# EasyEDA Pro project PMactrix.epro

# Schematic Schematic1
Board Name: Board1; Create Date: 2026-05-23; Page Name: P1; Project Name: test; Schematic Name: Schematic1; Update Date: 2026-05-23; Company: EasyEDA.com; Page Size: A4; Version: V1.0
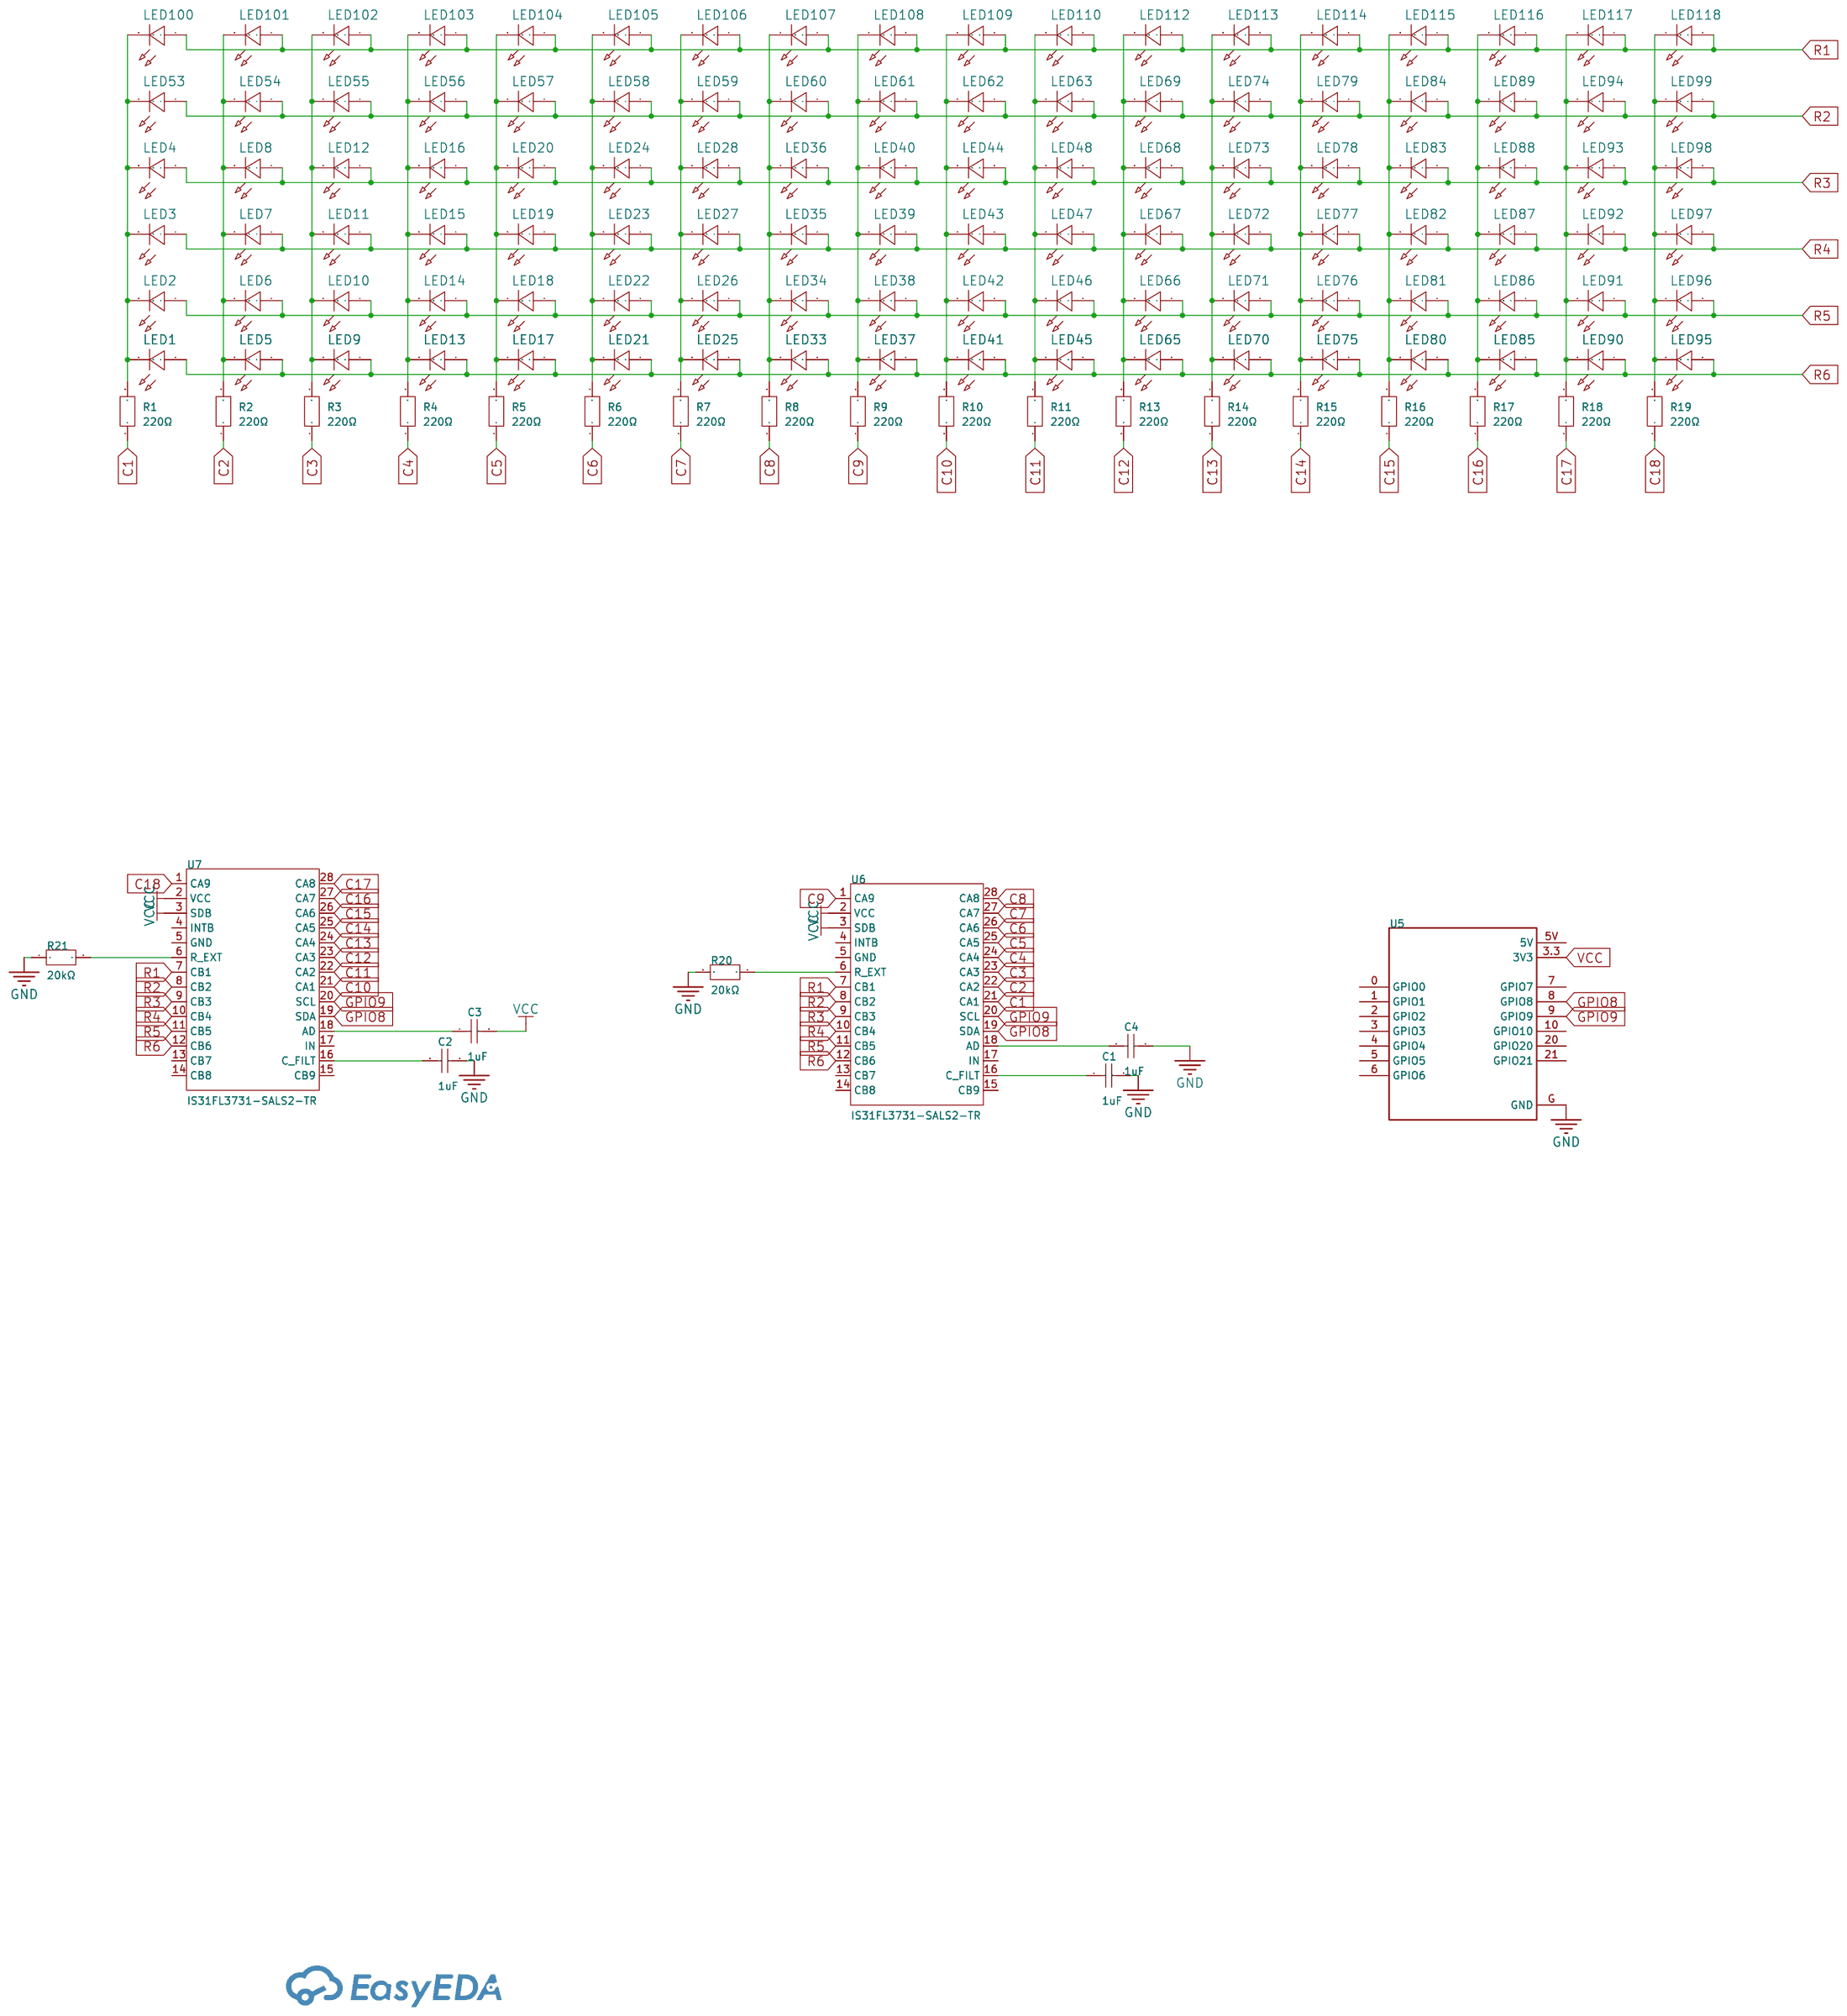
[diagram p0: schematic sheet]

## Parts
C1  1uF  [C0603]
C2  1uF  [C0603]
C3  1uF  [C0603]
C4  1uF  [C0603]
LED1  SZYY0603W  [LED0603-R-RD_WHITE]
LED2  SZYY0603W  [LED0603-R-RD_WHITE]
LED3  SZYY0603W  [LED0603-R-RD_WHITE]
LED4  SZYY0603W  [LED0603-R-RD_WHITE]
LED5  SZYY0603W  [LED0603-R-RD_WHITE]
LED6  SZYY0603W  [LED0603-R-RD_WHITE]
LED7  SZYY0603W  [LED0603-R-RD_WHITE]
LED8  SZYY0603W  [LED0603-R-RD_WHITE]
LED9  SZYY0603W  [LED0603-R-RD_WHITE]
LED10  SZYY0603W  [LED0603-R-RD_WHITE]
LED11  SZYY0603W  [LED0603-R-RD_WHITE]
LED12  SZYY0603W  [LED0603-R-RD_WHITE]
LED13  SZYY0603W  [LED0603-R-RD_WHITE]
LED14  SZYY0603W  [LED0603-R-RD_WHITE]
LED15  SZYY0603W  [LED0603-R-RD_WHITE]
LED16  SZYY0603W  [LED0603-R-RD_WHITE]
LED17  SZYY0603W  [LED0603-R-RD_WHITE]
LED18  SZYY0603W  [LED0603-R-RD_WHITE]
LED19  SZYY0603W  [LED0603-R-RD_WHITE]
LED20  SZYY0603W  [LED0603-R-RD_WHITE]
LED21  SZYY0603W  [LED0603-R-RD_WHITE]
LED22  SZYY0603W  [LED0603-R-RD_WHITE]
LED23  SZYY0603W  [LED0603-R-RD_WHITE]
LED24  SZYY0603W  [LED0603-R-RD_WHITE]
LED25  SZYY0603W  [LED0603-R-RD_WHITE]
LED26  SZYY0603W  [LED0603-R-RD_WHITE]
LED27  SZYY0603W  [LED0603-R-RD_WHITE]
LED28  SZYY0603W  [LED0603-R-RD_WHITE]
LED33  SZYY0603W  [LED0603-R-RD_WHITE]
LED34  SZYY0603W  [LED0603-R-RD_WHITE]
LED35  SZYY0603W  [LED0603-R-RD_WHITE]
LED36  SZYY0603W  [LED0603-R-RD_WHITE]
LED37  SZYY0603W  [LED0603-R-RD_WHITE]
LED38  SZYY0603W  [LED0603-R-RD_WHITE]
LED39  SZYY0603W  [LED0603-R-RD_WHITE]
LED40  SZYY0603W  [LED0603-R-RD_WHITE]
LED41  SZYY0603W  [LED0603-R-RD_WHITE]
LED42  SZYY0603W  [LED0603-R-RD_WHITE]
LED43  SZYY0603W  [LED0603-R-RD_WHITE]
LED44  SZYY0603W  [LED0603-R-RD_WHITE]
LED45  SZYY0603W  [LED0603-R-RD_WHITE]
LED46  SZYY0603W  [LED0603-R-RD_WHITE]
LED47  SZYY0603W  [LED0603-R-RD_WHITE]
LED48  SZYY0603W  [LED0603-R-RD_WHITE]
LED53  SZYY0603W  [LED0603-R-RD_WHITE]
LED54  SZYY0603W  [LED0603-R-RD_WHITE]
LED55  SZYY0603W  [LED0603-R-RD_WHITE]
LED56  SZYY0603W  [LED0603-R-RD_WHITE]
LED57  SZYY0603W  [LED0603-R-RD_WHITE]
LED58  SZYY0603W  [LED0603-R-RD_WHITE]
LED59  SZYY0603W  [LED0603-R-RD_WHITE]
LED60  SZYY0603W  [LED0603-R-RD_WHITE]
LED61  SZYY0603W  [LED0603-R-RD_WHITE]
LED62  SZYY0603W  [LED0603-R-RD_WHITE]
LED63  SZYY0603W  [LED0603-R-RD_WHITE]
LED65  SZYY0603W  [LED0603-R-RD_WHITE]
LED66  SZYY0603W  [LED0603-R-RD_WHITE]
LED67  SZYY0603W  [LED0603-R-RD_WHITE]
LED68  SZYY0603W  [LED0603-R-RD_WHITE]
LED69  SZYY0603W  [LED0603-R-RD_WHITE]
LED70  SZYY0603W  [LED0603-R-RD_WHITE]
LED71  SZYY0603W  [LED0603-R-RD_WHITE]
LED72  SZYY0603W  [LED0603-R-RD_WHITE]
LED73  SZYY0603W  [LED0603-R-RD_WHITE]
LED74  SZYY0603W  [LED0603-R-RD_WHITE]
LED75  SZYY0603W  [LED0603-R-RD_WHITE]
LED76  SZYY0603W  [LED0603-R-RD_WHITE]
LED77  SZYY0603W  [LED0603-R-RD_WHITE]
LED78  SZYY0603W  [LED0603-R-RD_WHITE]
LED79  SZYY0603W  [LED0603-R-RD_WHITE]
LED80  SZYY0603W  [LED0603-R-RD_WHITE]
LED81  SZYY0603W  [LED0603-R-RD_WHITE]
LED82  SZYY0603W  [LED0603-R-RD_WHITE]
LED83  SZYY0603W  [LED0603-R-RD_WHITE]
LED84  SZYY0603W  [LED0603-R-RD_WHITE]
LED85  SZYY0603W  [LED0603-R-RD_WHITE]
LED86  SZYY0603W  [LED0603-R-RD_WHITE]
LED87  SZYY0603W  [LED0603-R-RD_WHITE]
LED88  SZYY0603W  [LED0603-R-RD_WHITE]
LED89  SZYY0603W  [LED0603-R-RD_WHITE]
LED90  SZYY0603W  [LED0603-R-RD_WHITE]
LED91  SZYY0603W  [LED0603-R-RD_WHITE]
LED92  SZYY0603W  [LED0603-R-RD_WHITE]
LED93  SZYY0603W  [LED0603-R-RD_WHITE]
LED94  SZYY0603W  [LED0603-R-RD_WHITE]
LED95  SZYY0603W  [LED0603-R-RD_WHITE]
LED96  SZYY0603W  [LED0603-R-RD_WHITE]
LED97  SZYY0603W  [LED0603-R-RD_WHITE]
LED98  SZYY0603W  [LED0603-R-RD_WHITE]
LED99  SZYY0603W  [LED0603-R-RD_WHITE]
LED100  SZYY0603W  [LED0603-R-RD_WHITE]
LED101  SZYY0603W  [LED0603-R-RD_WHITE]
LED102  SZYY0603W  [LED0603-R-RD_WHITE]
LED103  SZYY0603W  [LED0603-R-RD_WHITE]
LED104  SZYY0603W  [LED0603-R-RD_WHITE]
LED105  SZYY0603W  [LED0603-R-RD_WHITE]
LED106  SZYY0603W  [LED0603-R-RD_WHITE]
LED107  SZYY0603W  [LED0603-R-RD_WHITE]
LED108  SZYY0603W  [LED0603-R-RD_WHITE]
LED109  SZYY0603W  [LED0603-R-RD_WHITE]
LED110  SZYY0603W  [LED0603-R-RD_WHITE]
LED112  SZYY0603W  [LED0603-R-RD_WHITE]
LED113  SZYY0603W  [LED0603-R-RD_WHITE]
LED114  SZYY0603W  [LED0603-R-RD_WHITE]
LED115  SZYY0603W  [LED0603-R-RD_WHITE]
LED116  SZYY0603W  [LED0603-R-RD_WHITE]
LED117  SZYY0603W  [LED0603-R-RD_WHITE]
LED118  SZYY0603W  [LED0603-R-RD_WHITE]
R1  220Ω  [R0603]
R2  220Ω  [R0603]
R3  220Ω  [R0603]
R4  220Ω  [R0603]
R5  220Ω  [R0603]
R6  220Ω  [R0603]
R7  220Ω  [R0603]
R8  220Ω  [R0603]
R9  220Ω  [R0603]
R10  220Ω  [R0603]
R11  220Ω  [R0603]
R13  220Ω  [R0603]
R14  220Ω  [R0603]
R15  220Ω  [R0603]
R16  220Ω  [R0603]
R17  220Ω  [R0603]
R18  220Ω  [R0603]
R19  220Ω  [R0603]
R20  20kΩ  [R0603]
R21  20kΩ  [R0603]
U5  -  [MODULE_ESP32-C3_SUPERMINI_TH]
U6  IS31FL3731-SALS2-TR  [SSOP-28_L10.2-W5.3-P0.65-LS7.8-BL]
U7  IS31FL3731-SALS2-TR  [SSOP-28_L10.2-W5.3-P0.65-LS7.8-BL]

## Library data of the parts
C1-C4 = CL10B105KA8NNNC: Capacitance:1uF Tolerance:±10% Tolerance:±10% Voltage Rating:25V Temperature Coefficient:X7R; LCSC Part Name: 1uF ±10% 25V; Supplier Part: C29936; Manufacturer: SAMSUNG(三星); Supplier Footprint: 0603; JLCPCB Part Class: Extended Part; Datasheet: https://item.szlcsc.com/datasheet/CL10B105KA8NNNC/30690.html; Supplier: LCSC; Tolerance: ±10%; Voltage Rating: 25V; Temperature Coefficient: X7R
LED1-LED28 LED33-LED48 LED53-LED63 LED65-LED110 LED112-LED118 = SZYY0603W: Lamp Holder Type:- Illumination Color:White Voltage - Forward(Vf):3.1V Voltage - Forward(Vf):3.1V Power(Watts):100mW Forward Current:30mA Wavelength - Dominant:- Wavelength - Dominant:- Peak Wavelength:- Diode Configuration:Discrete Diode Lens Color:Yello; LCSC Part Name: 白灯; Supplier Part: C434422; Manufacturer: yongyu(永裕光电); Supplier Footprint: 0603; JLCPCB Part Class: Extended Part; Datasheet: https://item.szlcsc.com/datasheet/SZYY0603W/431704.html; Supplier: LCSC; Illumination Color: White; Voltage - Forward(Vf): 3.1V; Power(Watts): 100mW; Forward Current: 30mA; Diode Configuration: Discrete Diode; Lens Color: Yellow Lens; Luminous Intensity: 359mcd; Viewing Angle: 120°; Operating Temperature: -40℃~+85℃
R1-R11 R13-R19 = CR0603F220RP05Z: Type:Thick Film Resistors Resistance: Tolerance:±1% Tolerance:±1% Power(Watts): Temperature Coefficient:±100ppm/℃ Temperature Coefficient:±100ppm/℃ Operating Temperature Range:-55℃~+155℃ Operating Temperature Range:-55℃~+155℃; LCSC Part Name: 厚膜电阻 220Ω ±1% 100mW; Supplier Part: C881327; Manufacturer: EVER OHMS(天二科技); Supplier Footprint: 0603; JLCPCB Part Class: Extended Part; Datasheet: https://atta.szlcsc.com/upload/public/pdf/source/20201014/C881429_ABC29D63C8D6A11EB63D87348B25AA7B.pdf; Supplier: LCSC; Type: Thick Film Resistors; Tolerance: ±1%; Temperature Coefficient: ±100ppm/℃; Operating Temperature Range: -55℃~+155℃
R20 R21 = FRC0603F2002TS: Type:Thick Film Resistor Resistance:20kΩ Tolerance:±1% Tolerance:±1% Power(Watts):100mW Voltage-Supply(Max):75V Temperature Coefficient:±100ppm/℃ Temperature Coefficient:±100ppm/℃ Operating Temperature:-55℃~+155℃ Operating Temperature:-55℃~+155℃; LCSC Part Name: 20kΩ ±1% 100mW 厚膜电阻; Supplier Part: C2907011; Manufacturer: FOJAN(富捷); Supplier Footprint: 0603; JLCPCB Part Class: Extended Part; Supplier: LCSC; Type: Thick Film Resistor; Tolerance: ±1%; Power(Watts): 100mW; Voltage-Supply(Max): 75V; Temperature Coefficient: ±100ppm/℃; Operating Temperature: -55℃~+155℃
U5 = ESP32-C3_SUPERMINI 1
U6 U7 = IS31FL3731-SALS2-TR: Type:- Voltage - Input(DC):2.7V~5.5V Voltage - Input(DC):2.7V~5.5V Frequency - Switching:400kHz Frequency - Switching:400kHz Number of Channels:18 Output Voltage:- Output Voltage:- Output Current:34mA Dimming:PWM Features:- Voltage - Input(AC):- Voltage -; Supplier Part: C2940545; Manufacturer: ISSI(美国芯成); Supplier Footprint: SSOP-28-208mil; JLCPCB Part Class: Extended Part; Datasheet: https://item.szlcsc.com/datasheet/IS31FL3731-SALS2-TR/3305928.html; Supplier: LCSC; Voltage - Input(DC): 2.7V~5.5V; Frequency - Switching: 400kHz; Number of Channels: 18; Output Current: 34mA; Dimming: PWM; Operating temperature: -40℃~+85℃; Switch Tube (Built-In/External): External

## Nets
GND: C1.2 C2.2 C4.2 R20.1 R21.1 U5.G(GND)
VCC: C3.2 U5.3.3(3V3) U6.2(VCC) U6.3(SDB) U7.2(VCC) U7.3(SDB)
C1: R1.1 U6.21(CA1)
C2: R2.1 U6.22(CA2)
C3: R3.1 U6.23(CA3)
C4: R4.1 U6.24(CA4)
C5: R5.1 U6.25(CA5)
C6: R6.1 U6.26(CA6)
C7: R7.1 U6.27(CA7)
C8: R8.1 U6.28(CA8)
C9: R9.1 U6.1(CA9)
C10: R10.1 U7.21(CA1)
C11: R11.1 U7.22(CA2)
C12: R13.1 U7.23(CA3)
C13: R14.1 U7.24(CA4)
C14: R15.1 U7.25(CA5)
C15: R16.1 U7.26(CA6)
C16: R17.1 U7.27(CA7)
C17: R18.1 U7.28(CA8)
C18: R19.1 U7.1(CA9)
GPIO8: U5.8(GPIO8) U6.19(SDA) U7.19(SDA)
GPIO9: U5.9(GPIO9) U6.20(SCL) U7.20(SCL)
R1: LED100.1(A) LED101.1(A) LED102.1(A) LED103.1(A) LED104.1(A) LED105.1(A) LED106.1(A) LED107.1(A) LED108.1(A) LED109.1(A) LED110.1(A) LED112.1(A) LED113.1(A) LED114.1(A) LED115.1(A) LED116.1(A) LED117.1(A) LED118.1(A) U6.7(CB1) U7.7(CB1)
R2: LED53.1(A) LED54.1(A) LED55.1(A) LED56.1(A) LED57.1(A) LED58.1(A) LED59.1(A) LED60.1(A) LED61.1(A) LED62.1(A) LED63.1(A) LED69.1(A) LED74.1(A) LED79.1(A) LED84.1(A) LED89.1(A) LED94.1(A) LED99.1(A) U6.8(CB2) U7.8(CB2)
R3: LED4.1(A) LED8.1(A) LED12.1(A) LED16.1(A) LED20.1(A) LED24.1(A) LED28.1(A) LED36.1(A) LED40.1(A) LED44.1(A) LED48.1(A) LED68.1(A) LED73.1(A) LED78.1(A) LED83.1(A) LED88.1(A) LED93.1(A) LED98.1(A) U6.9(CB3) U7.9(CB3)
R4: LED3.1(A) LED7.1(A) LED11.1(A) LED15.1(A) LED19.1(A) LED23.1(A) LED27.1(A) LED35.1(A) LED39.1(A) LED43.1(A) LED47.1(A) LED67.1(A) LED72.1(A) LED77.1(A) LED82.1(A) LED87.1(A) LED92.1(A) LED97.1(A) U6.10(CB4) U7.10(CB4)
R5: LED2.1(A) LED6.1(A) LED10.1(A) LED14.1(A) LED18.1(A) LED22.1(A) LED26.1(A) LED34.1(A) LED38.1(A) LED42.1(A) LED46.1(A) LED66.1(A) LED71.1(A) LED76.1(A) LED81.1(A) LED86.1(A) LED91.1(A) LED96.1(A) U6.11(CB5) U7.11(CB5)
R6: LED1.1(A) LED5.1(A) LED9.1(A) LED13.1(A) LED17.1(A) LED21.1(A) LED25.1(A) LED33.1(A) LED37.1(A) LED41.1(A) LED45.1(A) LED65.1(A) LED70.1(A) LED75.1(A) LED80.1(A) LED85.1(A) LED90.1(A) LED95.1(A) U6.12(CB6) U7.12(CB6)
$1N8371: LED1.2(C) LED2.2(C) LED3.2(C) LED4.2(C) LED53.2(C) LED100.2(C) R1.2
$1N8417: LED5.2(C) LED6.2(C) LED7.2(C) LED8.2(C) LED54.2(C) LED101.2(C) R2.2
$1N8463: LED9.2(C) LED10.2(C) LED11.2(C) LED12.2(C) LED55.2(C) LED102.2(C) R3.2
$1N8509: LED13.2(C) LED14.2(C) LED15.2(C) LED16.2(C) LED56.2(C) LED103.2(C) R4.2
$1N8555: LED17.2(C) LED18.2(C) LED19.2(C) LED20.2(C) LED57.2(C) LED104.2(C) R5.2
$1N8601: LED21.2(C) LED22.2(C) LED23.2(C) LED24.2(C) LED58.2(C) LED105.2(C) R6.2
$1N8647: LED25.2(C) LED26.2(C) LED27.2(C) LED28.2(C) LED59.2(C) LED106.2(C) R7.2
$1N8693: LED33.2(C) LED34.2(C) LED35.2(C) LED36.2(C) LED60.2(C) LED107.2(C) R8.2
$1N8739: LED37.2(C) LED38.2(C) LED39.2(C) LED40.2(C) LED61.2(C) LED108.2(C) R9.2
$1N8785: LED41.2(C) LED42.2(C) LED43.2(C) LED44.2(C) LED62.2(C) LED109.2(C) R10.2
$1N8831: LED45.2(C) LED46.2(C) LED47.2(C) LED48.2(C) LED63.2(C) LED110.2(C) R11.2
$1N31146: LED65.2(C) LED66.2(C) LED67.2(C) LED68.2(C) LED69.2(C) LED112.2(C) R13.2
$1N31526: LED70.2(C) LED71.2(C) LED72.2(C) LED73.2(C) LED74.2(C) LED113.2(C) R14.2
$1N31916: LED75.2(C) LED76.2(C) LED77.2(C) LED78.2(C) LED79.2(C) LED114.2(C) R15.2
$1N32316: LED80.2(C) LED81.2(C) LED82.2(C) LED83.2(C) LED84.2(C) LED115.2(C) R16.2
$1N32726: LED85.2(C) LED86.2(C) LED87.2(C) LED88.2(C) LED89.2(C) LED116.2(C) R17.2
$1N33146: LED90.2(C) LED91.2(C) LED92.2(C) LED93.2(C) LED94.2(C) LED117.2(C) R18.2
$1N33576: LED95.2(C) LED96.2(C) LED97.2(C) LED98.2(C) LED99.2(C) LED118.2(C) R19.2
$1N35107: R20.2 U6.6(R_EXT)
$1N35273: C1.1 U6.16(C_FILT)
$1N35811: C2.1 U7.16(C_FILT)
$1N35823: R21.2 U7.6(R_EXT)
$1N36756: C3.1 U7.18(AD)
$1N36796: C4.1 U6.18(AD)

Not connected (* = marked no-connect by the designer): U5 0(GPIO0) 1(GPIO1) 2(GPIO2) 3(GPIO3) 4(GPIO4) 5(GPIO5) 5V 6(GPIO6) 7(GPIO7) 10(GPIO10) 20(GPIO20) 21(GPIO21); U6 4(INTB) 5(GND) 13(CB7) 14(CB8) 15(CB9) 17(IN); U7 4(INTB) 5(GND) 13(CB7) 14(CB8) 15(CB9) 17(IN)

# Board PCB1
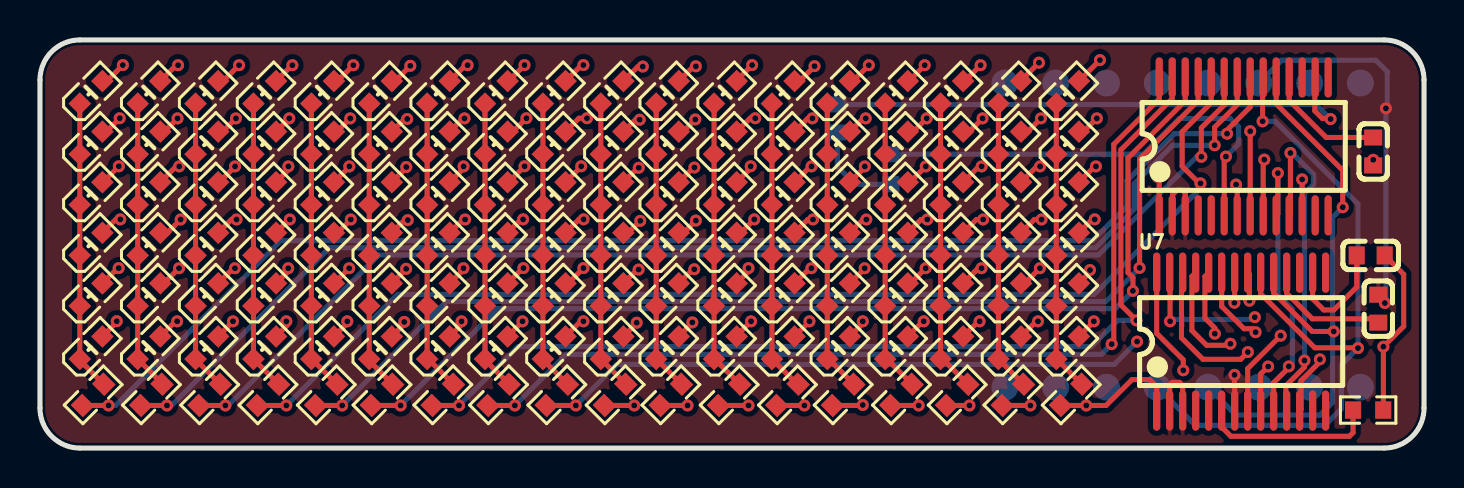
[diagram p1: board, top side]
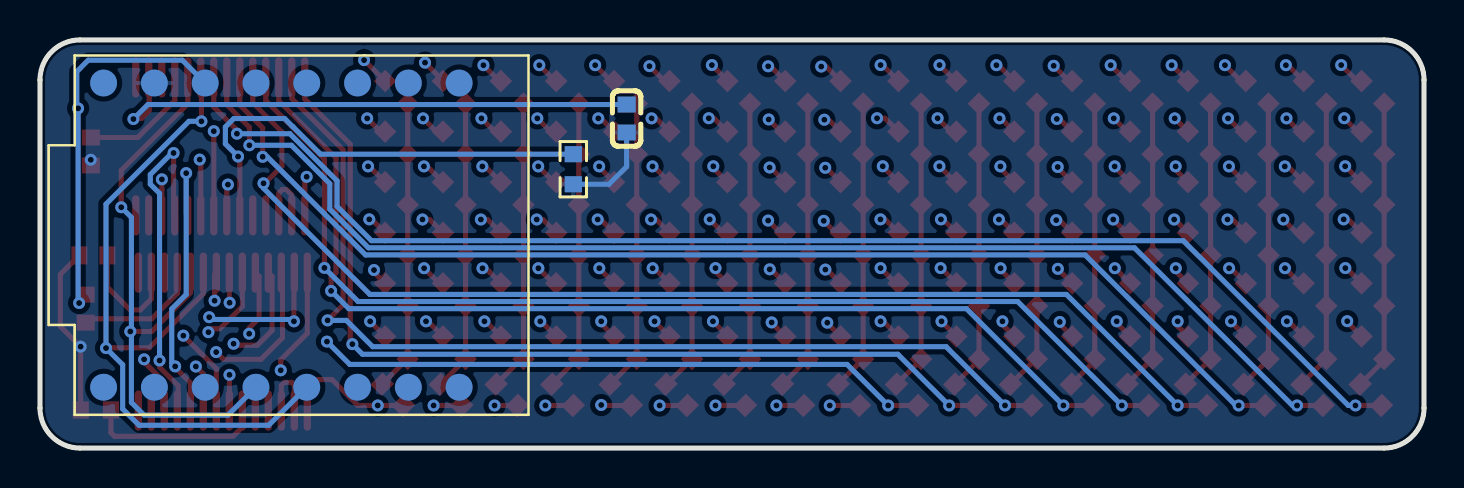
[diagram p2: board, bottom side, seen from below]

Outline 69.22 x 20.45 mm; copper layers: Top Layer, Inner1, Inner2, Bottom Layer. Coordinates in mm from the lower left corner of the outline.
Outline path: 0,18.45 0,2 arc(0.59,0.59) 2,0 67.22,0 arc(68.63,0.59) 69.22,2 69.22,18.45 arc(68.63,19.86) 67.22,20.45 2,20.45 arc(0.59,19.86) 0,18.45
Stack: Top Layer 0.035mm Outer layer thickness 1oz / Dielectric1 0.2104mm 7628 RC49% 8.6mil / Inner1 0.0152mm Inner layer thickness / Dielectric2 1.065mm 1.1mm H/HOZ Copper / Inner2 0.0152mm Inner layer thickness / Dielectric3 0.2104mm 7628 RC49% 8.6mil / Bottom Layer 0.035mm Outer layer thickness 1oz

## Design rules (mm)
template: Custom Config
spacing copperThickness1oz (default): track to track 0.102, other pairs 0.152 to 0.3
spacing copperThickness2oz: track to track 0.203, other pairs 0.152 to 0.3
track width copperThickness1oz (default): min 0.127, default 0.254, max 2.54
track width copperThickness2oz: min 0.203, default 0.254, max 2.54
differential pair differentialPair (default): width min 0.127, default 0.254, max 2.54; gap min 0.152, default 0.152
via viaSize (default): diameter min 0.5, default 0.6, max 10; hole min 0.3, default 0.3, max 6.3

## Placement (name value [footprint] x y rotation side)
C1  1uF  [C0603]  39.88 16.51 270 bottom
C2  1uF  [C0603]  66.55 9.65 0 top
C3  1uF  [C0603]  66.93 6.98 90 top
C4  1uF  [C0603]  66.68 14.86 270 top
LED1  SZYY0603W  [LED0603-R-RD_WHITE]  2.56 5.03 45 top
LED2  SZYY0603W  [LED0603-R-RD_WHITE]  2.56 7.69 45 top
LED3  SZYY0603W  [LED0603-R-RD_WHITE]  2.56 10.22 45 top
LED4  SZYY0603W  [LED0603-R-RD_WHITE]  2.56 12.76 45 top
LED5  SZYY0603W  [LED0603-R-RD_WHITE]  5.45 5.03 45 top
LED6  SZYY0603W  [LED0603-R-RD_WHITE]  5.45 7.69 45 top
LED7  SZYY0603W  [LED0603-R-RD_WHITE]  5.45 10.22 45 top
LED8  SZYY0603W  [LED0603-R-RD_WHITE]  5.45 12.76 45 top
LED9  SZYY0603W  [LED0603-R-RD_WHITE]  8.35 5.03 45 top
LED10  SZYY0603W  [LED0603-R-RD_WHITE]  8.35 7.69 45 top
LED11  SZYY0603W  [LED0603-R-RD_WHITE]  8.35 10.22 45 top
LED12  SZYY0603W  [LED0603-R-RD_WHITE]  8.35 12.76 45 top
LED13  SZYY0603W  [LED0603-R-RD_WHITE]  11.24 5.03 45 top
LED14  SZYY0603W  [LED0603-R-RD_WHITE]  11.24 7.69 45 top
LED15  SZYY0603W  [LED0603-R-RD_WHITE]  11.24 10.22 45 top
LED16  SZYY0603W  [LED0603-R-RD_WHITE]  11.24 12.76 45 top
LED17  SZYY0603W  [LED0603-R-RD_WHITE]  14.14 5.03 45 top
LED18  SZYY0603W  [LED0603-R-RD_WHITE]  14.14 7.69 45 top
LED19  SZYY0603W  [LED0603-R-RD_WHITE]  14.14 10.22 45 top
LED20  SZYY0603W  [LED0603-R-RD_WHITE]  14.14 12.76 45 top
LED21  SZYY0603W  [LED0603-R-RD_WHITE]  17.03 5.03 45 top
LED22  SZYY0603W  [LED0603-R-RD_WHITE]  17.03 7.69 45 top
LED23  SZYY0603W  [LED0603-R-RD_WHITE]  17.03 10.22 45 top
LED24  SZYY0603W  [LED0603-R-RD_WHITE]  17.03 12.76 45 top
LED25  SZYY0603W  [LED0603-R-RD_WHITE]  19.93 5.03 45 top
LED26  SZYY0603W  [LED0603-R-RD_WHITE]  19.93 7.69 45 top
LED27  SZYY0603W  [LED0603-R-RD_WHITE]  19.93 10.22 45 top
LED28  SZYY0603W  [LED0603-R-RD_WHITE]  19.93 12.76 45 top
LED33  SZYY0603W  [LED0603-R-RD_WHITE]  22.82 5.03 45 top
LED34  SZYY0603W  [LED0603-R-RD_WHITE]  22.82 7.69 45 top
LED35  SZYY0603W  [LED0603-R-RD_WHITE]  22.82 10.22 45 top
LED36  SZYY0603W  [LED0603-R-RD_WHITE]  22.82 12.76 45 top
LED37  SZYY0603W  [LED0603-R-RD_WHITE]  25.72 5.03 45 top
LED38  SZYY0603W  [LED0603-R-RD_WHITE]  25.72 7.69 45 top
LED39  SZYY0603W  [LED0603-R-RD_WHITE]  25.72 10.22 45 top
LED40  SZYY0603W  [LED0603-R-RD_WHITE]  25.72 12.76 45 top
LED41  SZYY0603W  [LED0603-R-RD_WHITE]  28.61 5.03 45 top
LED42  SZYY0603W  [LED0603-R-RD_WHITE]  28.61 7.69 45 top
LED43  SZYY0603W  [LED0603-R-RD_WHITE]  28.61 10.22 45 top
LED44  SZYY0603W  [LED0603-R-RD_WHITE]  28.61 12.76 45 top
LED45  SZYY0603W  [LED0603-R-RD_WHITE]  31.38 5.03 45 top
LED46  SZYY0603W  [LED0603-R-RD_WHITE]  31.38 7.69 45 top
LED47  SZYY0603W  [LED0603-R-RD_WHITE]  31.38 10.22 45 top
LED48  SZYY0603W  [LED0603-R-RD_WHITE]  31.38 12.76 45 top
LED53  SZYY0603W  [LED0603-R-RD_WHITE]  2.56 15.29 45 top
LED54  SZYY0603W  [LED0603-R-RD_WHITE]  5.45 15.29 45 top
LED55  SZYY0603W  [LED0603-R-RD_WHITE]  8.35 15.29 45 top
LED56  SZYY0603W  [LED0603-R-RD_WHITE]  11.24 15.29 45 top
LED57  SZYY0603W  [LED0603-R-RD_WHITE]  14.14 15.29 45 top
LED58  SZYY0603W  [LED0603-R-RD_WHITE]  17.03 15.29 45 top
LED59  SZYY0603W  [LED0603-R-RD_WHITE]  19.93 15.29 45 top
LED60  SZYY0603W  [LED0603-R-RD_WHITE]  22.82 15.29 45 top
LED61  SZYY0603W  [LED0603-R-RD_WHITE]  25.72 15.29 45 top
LED62  SZYY0603W  [LED0603-R-RD_WHITE]  28.61 15.29 45 top
LED63  SZYY0603W  [LED0603-R-RD_WHITE]  31.38 15.29 45 top
LED65  SZYY0603W  [LED0603-R-RD_WHITE]  34.28 5.03 45 top
LED66  SZYY0603W  [LED0603-R-RD_WHITE]  34.28 7.69 45 top
LED67  SZYY0603W  [LED0603-R-RD_WHITE]  34.28 10.22 45 top
LED68  SZYY0603W  [LED0603-R-RD_WHITE]  34.28 12.76 45 top
LED69  SZYY0603W  [LED0603-R-RD_WHITE]  34.28 15.29 45 top
LED70  SZYY0603W  [LED0603-R-RD_WHITE]  37.17 5.03 45 top
LED71  SZYY0603W  [LED0603-R-RD_WHITE]  37.17 7.69 45 top
LED72  SZYY0603W  [LED0603-R-RD_WHITE]  37.17 10.22 45 top
LED73  SZYY0603W  [LED0603-R-RD_WHITE]  37.17 12.76 45 top
LED74  SZYY0603W  [LED0603-R-RD_WHITE]  37.17 15.29 45 top
LED75  SZYY0603W  [LED0603-R-RD_WHITE]  39.94 5.03 45 top
LED76  SZYY0603W  [LED0603-R-RD_WHITE]  39.94 7.69 45 top
LED77  SZYY0603W  [LED0603-R-RD_WHITE]  39.94 10.22 45 top
LED78  SZYY0603W  [LED0603-R-RD_WHITE]  39.94 12.76 45 top
LED79  SZYY0603W  [LED0603-R-RD_WHITE]  39.94 15.29 45 top
LED80  SZYY0603W  [LED0603-R-RD_WHITE]  42.83 5.03 45 top
LED81  SZYY0603W  [LED0603-R-RD_WHITE]  42.83 7.69 45 top
LED82  SZYY0603W  [LED0603-R-RD_WHITE]  42.83 10.22 45 top
LED83  SZYY0603W  [LED0603-R-RD_WHITE]  42.83 12.76 45 top
LED84  SZYY0603W  [LED0603-R-RD_WHITE]  42.83 15.29 45 top
LED85  SZYY0603W  [LED0603-R-RD_WHITE]  45.6 5.03 45 top
LED86  SZYY0603W  [LED0603-R-RD_WHITE]  45.6 7.69 45 top
LED87  SZYY0603W  [LED0603-R-RD_WHITE]  45.6 10.22 45 top
LED88  SZYY0603W  [LED0603-R-RD_WHITE]  45.6 12.76 45 top
LED89  SZYY0603W  [LED0603-R-RD_WHITE]  45.6 15.29 45 top
LED90  SZYY0603W  [LED0603-R-RD_WHITE]  48.5 5.03 45 top
LED91  SZYY0603W  [LED0603-R-RD_WHITE]  48.5 7.69 45 top
LED92  SZYY0603W  [LED0603-R-RD_WHITE]  48.5 10.22 45 top
LED93  SZYY0603W  [LED0603-R-RD_WHITE]  48.5 12.76 45 top
LED94  SZYY0603W  [LED0603-R-RD_WHITE]  48.5 15.29 45 top
LED95  SZYY0603W  [LED0603-R-RD_WHITE]  51.39 5.03 45 top
LED96  SZYY0603W  [LED0603-R-RD_WHITE]  51.39 7.69 45 top
LED97  SZYY0603W  [LED0603-R-RD_WHITE]  51.39 10.22 45 top
LED98  SZYY0603W  [LED0603-R-RD_WHITE]  51.39 12.76 45 top
LED99  SZYY0603W  [LED0603-R-RD_WHITE]  51.39 15.29 45 top
LED100  SZYY0603W  [LED0603-R-RD_WHITE]  2.56 17.82 45 top
LED101  SZYY0603W  [LED0603-R-RD_WHITE]  5.45 17.82 45 top
LED102  SZYY0603W  [LED0603-R-RD_WHITE]  8.35 17.82 45 top
LED103  SZYY0603W  [LED0603-R-RD_WHITE]  11.24 17.82 45 top
LED104  SZYY0603W  [LED0603-R-RD_WHITE]  14.14 17.82 45 top
LED105  SZYY0603W  [LED0603-R-RD_WHITE]  17.03 17.82 45 top
LED106  SZYY0603W  [LED0603-R-RD_WHITE]  19.93 17.82 45 top
LED107  SZYY0603W  [LED0603-R-RD_WHITE]  22.82 17.82 45 top
LED108  SZYY0603W  [LED0603-R-RD_WHITE]  25.72 17.82 45 top
LED109  SZYY0603W  [LED0603-R-RD_WHITE]  28.61 17.82 45 top
LED110  SZYY0603W  [LED0603-R-RD_WHITE]  31.38 17.82 45 top
LED112  SZYY0603W  [LED0603-R-RD_WHITE]  34.28 17.82 45 top
LED113  SZYY0603W  [LED0603-R-RD_WHITE]  37.17 17.82 45 top
LED114  SZYY0603W  [LED0603-R-RD_WHITE]  39.94 17.82 45 top
LED115  SZYY0603W  [LED0603-R-RD_WHITE]  42.83 17.82 45 top
LED116  SZYY0603W  [LED0603-R-RD_WHITE]  45.6 17.82 45 top
LED117  SZYY0603W  [LED0603-R-RD_WHITE]  48.5 17.82 45 top
LED118  SZYY0603W  [LED0603-R-RD_WHITE]  51.39 17.82 45 top
R1  220Ω  [R0603]  2.66 2.67 45 top
R2  220Ω  [R0603]  5.57 2.67 45 top
R3  220Ω  [R0603]  8.49 2.67 45 top
R4  220Ω  [R0603]  11.4 2.67 45 top
R5  220Ω  [R0603]  14.32 2.67 45 top
R6  220Ω  [R0603]  17.1 2.67 45 top
R7  220Ω  [R0603]  20.15 2.67 45 top
R8  220Ω  [R0603]  22.93 2.67 45 top
R9  220Ω  [R0603]  25.85 2.67 45 top
R10  220Ω  [R0603]  28.76 2.67 45 top
R11  220Ω  [R0603]  31.55 2.67 45 top
R13  220Ω  [R0603]  34.46 2.67 45 top
R14  220Ω  [R0603]  37.38 2.67 45 top
R15  220Ω  [R0603]  40.17 2.67 45 top
R16  220Ω  [R0603]  43.08 2.67 45 top
R17  220Ω  [R0603]  45.87 2.67 45 top
R18  220Ω  [R0603]  48.66 2.67 45 top
R19  220Ω  [R0603]  51.57 2.67 45 top
R20  20kΩ  [R0603]  42.55 13.97 90 bottom
R21  20kΩ  [R0603]  66.42 1.91 180 top
U5  -  [MODULE_ESP32-C3_SUPERMINI_TH]  56.13 10.67 90 bottom
U6  IS31FL3731-SALS2-TR  [SSOP-28_L10.2-W5.3-P0.65-LS7.8-BL]  60.2 15.11 0 top
U7  IS31FL3731-SALS2-TR  [SSOP-28_L10.2-W5.3-P0.65-LS7.8-BL]  60.07 5.33 0 top

## Footprints (pads in the part's own frame, mm; a bottom-side part is the same pattern mirrored in y, then rotated)
C0603
  rect 0.8x0.9 smd: 1(-0.7,0) 2(0.7,0)
LED0603-R-RD_WHITE
  rect 0.8x0.8 smd: 1(0.8,0) 2(-0.8,0)
MODULE_ESP32-C3_SUPERMINI_TH
  round 1.348 smd: 0(7.62,-7.88) 1(7.62,-5.34) 2(7.62,-2.8) 3(7.62,-0.26) 4(7.62,2.28) 5(-7.62,9.9) 5V(7.62,9.9) 6(-7.62,7.36) 7(-7.62,4.82) 8(-7.62,2.28) 9(-7.62,-0.26) 10(-7.62,-2.8) 20(-7.62,-5.34) 21(-7.62,-7.88) 33(7.62,4.82) G(7.62,7.36)
R0603
  rect 0.806x0.864 smd: 1(-0.753,0) 2(0.753,0)
SSOP-28_L10.2-W5.3-P0.65-LS7.8-BL
  oval 0.364x2.015 smd: 1(-4.225,-3.455) 2(-3.575,-3.455) 3(-2.925,-3.455) 4(-2.275,-3.455) 5(-1.625,-3.455) 6(-0.975,-3.455) 7(-0.325,-3.455) 8(0.325,-3.455) 9(0.975,-3.455) 10(1.625,-3.455) 11(2.275,-3.455) 12(2.925,-3.455) 13(3.575,-3.455) 14(4.225,-3.455) 15(4.225,3.455) 16(3.575,3.455) 17(2.925,3.455) 18(2.275,3.455) 19(1.625,3.455) 20(0.975,3.455) 21(0.325,3.455) 22(-0.325,3.455) 23(-0.975,3.455) 24(-1.625,3.455) 25(-2.275,3.455) 26(-2.925,3.455) 27(-3.575,3.455) 28(-4.225,3.455)

## Nets
As in the schematic, except:
VCC: C3.2 U5.33 U6.2 U6.3 U7.2 U7.3

Pads without a net: U5 0 1 2 3 4 5 5V 6 7 10 20 21; U6 4 5 13 14 15 17; U7 4 5 13 14 15 17

## Via types
v1: diameter 0.6, hole 0.3, Top Layer to Bottom Layer, 167 vias

## Routing (per net, layer and track width the routed paths; a pad name or vN(x,y) marks a point on that pad's centre or on a via; arc(x,y) is an arc through that point)
GND: length 13.3
  Top Layer w0.254: C2.2 68.2,8.7 68.2,6.1 v1(67.18,5.08) 67.18,1.91 R21.1
  Bottom Layer w0.254: C1.2 39.88,14.1 40.76,13.22 R20.1
  vias: v1(66.68,14.44)
VCC: length 25.6
  Top Layer w0.254: U7.2 56.5,3.16 56.63,3.29 56.99,3.29 57.15,3.14 57.15,1.88 ; U6.3 57.27,12.77 57.09,12.95 56.9,12.95 56.64,12.7 56.64,11.68 U6.2 ; C3.2 66.93,7.59 v1(67.26,7.27)
  Bottom Layer w0.254: v1(67.26,7.27) 67.31,7.32 v1(67.31,17.02) 67.37,17.08 67.37,18.86 66.8,19.43 62.1,19.43 U5.33
C1: length 66.9
  Top Layer w0.254: U6.21 60.52,17.09 59.37,15.93 v1(59.37,15.75) ; R1.1 v1(3.43,2.13)
  Bottom Layer w0.254: v1(59.37,15.75) 56.72,15.75 54.36,13.39 54.36,12.11 52.64,10.39 12.04,10.39 3.79,2.13 v1(3.43,2.13)
C2: length 63.7
  Top Layer w0.254: R2.1 v1(6.35,2.13) ; v1(58.74,15.17) 58.74,16.07 59.87,17.2 U6.22
  Bottom Layer w0.254: v1(58.74,15.17) 56.64,15.17 54.72,13.25 54.72,11.97 52.79,10.03 14.48,10.03 6.58,2.13 v1(6.35,2.13)
C3: length 59.7
  Top Layer w0.254: R3.1 v1(9.27,2.13) ; v1(58.08,14.59) 58.08,16.04 59.22,17.19 U6.23
  Bottom Layer w0.254: v1(9.27,2.13) 9.41,2.13 16.95,9.68 52.93,9.68 57.85,14.59 v1(58.08,14.59)
C4: length 58.2
  Top Layer w0.254: U6.24 58.57,17.3 57.12,15.84 57.12,14.12 57.97,13.26 v1(58.04,13.26) ; R4.1 v1(12.32,2.13)
  Bottom Layer w0.254: v1(58.04,13.26) 58.04,13.02 52.72,7.7 17.88,7.7 v1(12.32,2.13)
C5: length 54.8
  Top Layer w0.254: R5.1 v1(15.11,2.13) ; U6.25 57.92,17.41 54.99,14.48 v1(54.99,9.03)
  Bottom Layer w0.254: v1(15.11,2.13) 20.32,7.34 53.31,7.34 v1(54.99,9.03)
C6: length 52.4
  Top Layer w0.254: R6.1 v1(18.03,2.13) ; v1(54.66,7.87) 54.66,8.54 54.41,8.79 54.41,14.53 57.27,17.4 U6.26
  Bottom Layer w0.254: v1(18.03,2.13) 22.88,6.98 53.77,6.98 v1(54.66,7.87)
C7: length 50.5
  Top Layer w0.254: v1(54.83,6.4) 54.06,7.17 54.06,14.94 56.62,17.51 U6.27 ; R7.1 v1(20.96,2.13)
  Bottom Layer w0.254: v1(54.83,6.4) 53.9,6.4 52.58,5.08 23.9,5.08 v1(20.96,2.13)
C8: length 46.8
  Top Layer w0.254: R8.1 v1(23.75,2.13) ; v1(53.59,5.21) 53.7,5.31 53.7,15.22 55.97,17.49 U6.28
  Bottom Layer w0.254: v1(23.75,2.13) 26.31,4.7 53.09,4.7 v1(53.59,5.21)
C9: length 42.1
  Top Layer w0.254: v1(55.88,13.59) 55.97,13.5 U6.1 ; R9.1 v1(26.8,2.13)
  Inner2 w0.254: v1(54.86,5.33) 54.86,5.61 55.57,6.32 55.57,9.27 54.86,9.97 54.86,12.57 v1(55.88,13.59)
  Bottom Layer w0.254: v1(26.8,2.13) 28.85,4.19 53.72,4.19 v1(54.86,5.33)
C10: length 36
  Top Layer w0.254: v1(60.48,7.38) 60.48,8.7 U7.21 ; R10.1 v1(29.72,2.13)
  Inner2 w0.254: v1(60.48,7.38) 60.48,7.11 60.06,6.68 58.19,6.68 56.13,4.62 48.47,4.62 48.42,4.57 48.13,4.57 46.61,3.05 30.63,3.05 v1(29.72,2.13)
C11: length 32.4
  Top Layer w0.254: v1(59.73,7.28) 59.75,7.3 U7.22 ; R11.1 v1(32.39,2.13)
  Inner1 w0.254: v1(59.73,7.28) 58.73,7.28 55.76,4.3 34.55,4.3 v1(32.39,2.13)
C12: length 32.8
  Top Layer w0.254: v1(60.79,5.81) 60.62,5.98 60.21,5.98 59.1,7.1 U7.23 ; R13.1 v1(35.43,2.13)
  Inner1 w0.254: v1(60.79,5.81) 59.52,5.81 58.88,6.44 58.4,6.44 55.89,3.94 37.24,3.94 v1(35.43,2.13)
C13: length 26.7
  Top Layer w0.254: U7.24 58.26,8.6 58.26,6.51 58.75,6.02 v1(58.75,5.73) ; R14.1 v1(38.23,2.13)
  Inner1 w0.254: v1(38.23,2.13) 38.61,2.13 39.78,3.3 41.79,3.3 42.04,3.56 56.02,3.56 58.19,5.73 v1(58.75,5.73)
C14: length 26.4
  Top Layer w0.254: 39.63,2.13 41.12,2.13 v1(41.15,2.16) ; U7.25 57.61,8.6 57.61,5.89 58.35,5.15 59.46,5.15 v1(59.53,5.23)
  Inner1 w0.254: v1(59.53,5.23) 57.51,3.2 42.19,3.2 v1(41.15,2.16)
C15: length 26.2
  Top Layer w0.254: v1(60.41,4.81) 60.04,4.45 58.17,4.45 57.09,5.52 57.09,6.1 57.09,6.11 57.09,6.59 57.09,6.6 57.09,8.73 57.15,8.79 ; R16.1 v1(43.94,2.13)
  Inner1 w0.254: v1(60.41,4.81) 60.06,4.81 58.09,2.84 44.65,2.84 v1(43.94,2.13)
C16: length 24
  Top Layer w0.254: R17.1 v1(46.48,2.13) ; U7.27 56.52,8.77 v1(56.52,6.35)
  Inner2 w0.254: v1(60.75,6.56) 60.67,6.56 60.42,6.31 58.32,6.31 56.28,4.27 48.62,4.27 v1(46.48,2.13)
  Bottom Layer w0.254: v1(56.52,6.35) 56.61,6.44 60.64,6.44 v1(60.75,6.56)
C17: length 15.2
  Top Layer w0.254: v1(57.18,3.9) 57.18,4.42 55.85,5.75 U7.28 ; R18.1 v1(49.53,2.13)
  Inner2 w0.254: v1(49.53,2.13) 51.29,3.9 v1(57.18,3.9)
C18: length 6.7
  Top Layer w0.254: U7.1 55.85,3.08 55.5,3.43 54.61,3.43 53.32,2.13 v1(52.32,2.13) R19.1
GPIO8: length 29.8
  Top Layer w0.254: v1(64.7,5.84) 63.63,5.84 61.7,7.77 U7.19 ; v1(65.15,12.06) 65.15,13.91 61.82,17.24 U6.19
  Bottom Layer w0.254: U5.8 59.81,1.65 64.01,1.65 64.64,2.29 64.64,11.56 v1(65.15,12.06)
GPIO9: length 36.6
  Top Layer w0.254: v1(65.91,5.01) 65.9,5.02 63.75,5.02 61.05,7.73 U7.20 ; U6.20 61.14,18.54 v1(61.14,16.37)
  Bottom Layer w0.254: U5.9 57.78,1.14 64.26,1.14 65.08,1.96 65.08,4.18 v1(65.91,5.01) ; 65.91,5.08 65.91,12.22 61.77,16.37 v1(61.14,16.37)
R1: length 97.9
  Top Layer w0.254: LED118.1 51.96,18.39 v1(53.01,19.44) ; v1(4.14,19.19) 3.34,18.39 LED100.1 ; v1(38.74,19.13) 37.99,18.39 LED113.1 ; LED101.1 6.81,19.18 v1(6.91,19.18) ; 20.49,18.39 21.29,19.18 v1(21.39,19.18) ; LED110.1 32.68,19.13 v1(32.8,19.13) ; U6.7 59.87,13.14 v1(59.82,13.2) ; LED117.1 49.06,18.41 v1(49.96,19.31) ; v1(41.45,19.18) 40.66,18.39 LED114.1 ; v1(9.96,19.18) 9.16,18.39 LED102.1 ; v1(47.04,19.18) 46.25,18.39 LED116.1 ; LED115.1 43.45,18.39 v1(44.25,19.18) ; U7.7 59.75,3.23 59.74,3.24 v1(59.74,3.67) ; v1(35.61,19.19) 34.84,18.41 LED112.1 ; v1(30.15,19.11) 29.9,19.11 LED109.1 ; LED107.1 23.43,18.39 v1(24.23,19.19) ; LED105.1 17.76,18.39 v1(18.52,19.15) ; v1(15.67,19.18) 14.88,18.39 14.7,18.39 ; v1(27.18,19.19) 27.08,19.19 LED108.1 ; LED103.1 12.6,19.18 v1(12.62,19.18)
  Inner1 w0.254: v1(59.82,13.2) 59.94,13.33 59.94,17.02 57.53,19.44 v1(53.01,19.44) 52.76,19.19 v1(35.61,19.19) v1(27.18,19.19) v1(24.23,19.19) v1(4.14,19.19)
  Inner2 w0.254: v1(59.74,3.67) 60.18,3.67 61.47,4.95 61.47,11.18 59.82,12.83 v1(59.82,13.2)
R2: length 97.7
  Top Layer w0.254: LED62.1 29.77,16.45 v1(29.99,16.45) ; LED89.1 46.47,15.85 v1(47.14,16.52) ; v1(41.3,16.52) 41.17,16.52 LED79.1 ; LED63.1 32.16,15.85 v1(32.77,16.46) ; v1(27.35,16.52) 26.95,16.52 LED61.1 ; LED58.1 18.23,16.49 v1(18.36,16.49) ; LED69.1 35.51,16.52 v1(35.77,16.52) ; LED53.1 3.32,15.85 v1(3.99,16.52) ; v1(44.34,16.52) 43.68,15.85 LED84.1 ; LED54.1 6.22,15.85 v1(6.88,16.52) ; LED56.1 12.47,16.51 v1(12.47,16.52) ; v1(62.05,5.63) 60.4,3.98 U7.8 ; v1(24.33,16.52) 23.66,15.85 LED60.1 ; v1(15.52,16.52) 14.85,15.85 14.7,15.85 ; LED74.1 38.4,16.52 v1(38.63,16.52) ; LED94.1 49.4,15.85 v1(50.06,16.52) ; LED55.1 9.14,15.85 v1(9.8,16.52) ; 20.49,15.85 21.16,16.52 v1(21.23,16.52) ; v1(60.52,15.88) U6.8 ; v1(52.85,16.52) 52.19,15.85 LED99.1
  Inner1 w0.254: v1(3.99,16.52) v1(24.33,16.52) v1(27.35,16.52) v1(35.77,16.52) 52.85,16.52 v1(52.85,16.52)
  Inner2 w0.254: v1(62.05,5.63) 61.82,5.86 61.82,11.32 61.61,11.53 61.61,12.08 62.48,12.95 62.48,14.01 60.62,15.88 v1(60.52,15.88) 60.52,15.93 59.94,16.52 v1(52.85,16.52)
R3: length 98.2
  Top Layer w0.254: 20.49,13.32 21.18,14.01 v1(21.18,14.11) ; LED98.1 52.75,14.11 v1(52.81,14.11) ; LED4.1 3.15,13.32 v1(3.94,14.12) ; LED88.1 46.96,14.11 v1(47.09,14.11) ; LED48.1 32.68,14.06 v1(32.73,14.06) ; LED68.1 35.54,14.02 v1(35.54,14.12) ; v1(38.58,14.11) 38.53,14.11 LED73.1 ; v1(61.23,14.45) 61.17,14.4 U6.9 ; LED8.1 6.81,14.11 v1(6.96,14.11) ; v1(61.42,4.09) 61.05,3.71 U7.9 ; v1(18.32,14.08) 18.32,14.04 LED24.1 ; 14.7,13.32 15.47,14.09 v1(15.47,14.11) ; LED44.1 29.9,14.04 v1(29.95,14.04) ; v1(41.25,14.11) 41.25,14.07 LED78.1 ; v1(12.42,14.11) 12.42,13.94 LED16.1 ; LED83.1 43.51,13.32 v1(44.3,14.11) ; LED36.1 23.44,13.32 v1(24.23,14.12) ; v1(9.75,14.11) 8.96,13.32 LED12.1 ; LED93.1 49.85,14.11 v1(50.01,14.11) ; LED40.1 27.07,14.11 v1(27.07,14.12)
  Inner1 w0.254: v1(3.94,14.12) v1(24.23,14.12) v1(27.07,14.12) v1(35.54,14.12) 52.8,14.12 v1(52.81,14.11) ; v1(61.42,4.09) 63.7,6.36 63.7,14.92 63.25,15.37 62.14,15.37 v1(61.23,14.45)
  Inner2 w0.254: v1(52.81,14.11) 52.86,14.17 57.68,14.17 57.84,14.01 60.79,14.01 v1(61.23,14.45)
R4: length 94.2
  Top Layer w0.254: 14.7,10.79 14.88,10.79 v1(15.54,11.45) ; v1(52.75,11.46) 52.63,11.46 51.96,10.79 ; U6.10 61.91,11.74 v1(61.91,13.77) ; 37.74,10.79 38.4,11.45 v1(38.66,11.45) ; v1(32.8,11.4) 32.19,10.79 31.95,10.79 ; v1(9.83,11.45) 9.58,11.45 8.91,10.79 ; v1(41.32,11.45) 41.17,11.45 40.5,10.79 ; v1(47.17,11.45) 46.83,11.45 46.17,10.79 ; 17.6,10.79 18.23,11.42 v1(18.39,11.42) ; v1(30.02,11.38) 29.42,10.79 29.18,10.79 ; v1(44.37,11.45) 44.06,11.45 43.4,10.79 ; v1(35.72,11.46) 35.05,10.79 34.84,10.79 ; U7.10 61.7,3.28 62.46,4.04 v1(62.46,4.09) ; v1(21.26,11.45) 21.16,11.45 20.49,10.79 ; v1(50.09,11.45) 49.73,11.45 49.06,10.79 ; 11.81,10.79 12.47,11.45 v1(12.5,11.45) ; v1(27.19,11.46) 26.95,11.46 26.28,10.79 ; 6.02,10.79 6.37,10.79 v1(7.03,11.45) ; 23.39,10.79 24.06,11.46 v1(24.16,11.46) ; 3.12,10.79 3.79,11.46 v1(4.02,11.46)
  Inner1 w0.254: v1(61.91,13.77) 59.59,11.46 v1(52.75,11.46) v1(35.72,11.46) v1(27.19,11.46) v1(24.16,11.46) v1(4.02,11.46)
  Bottom Layer w0.254: v1(62.46,4.09) 62.63,4.26 62.63,6.97 61.91,7.69 v1(61.91,13.77)
R5: length 98.9
  Top Layer w0.254: LED71.1 38.49,9.01 v1(38.58,9.01) ; LED66.1 35.43,8.85 v1(35.43,9.02) ; v1(3.94,9.02) 3.89,9.02 LED2.1 ; v1(32.72,8.96) 32.65,8.96 LED46.1 ; v1(24.18,9.02) 24.15,9.02 LED34.1 ; v1(18.31,8.98) 18.31,8.97 LED22.1 ; LED14.1 12.41,8.86 v1(12.41,9.01) ; v1(47.09,9.01) 46.92,9.01 46.74,8.83 46.74,8.82 LED86.1 ; v1(44.29,9.01) 43.53,8.25 LED81.1 ; v1(21.18,9.01) 21.18,8.94 20.49,8.25 ; U6.11 62.53,11.72 v1(62.53,14.78) ; LED91.1 49.25,8.25 v1(50.01,9.01) ; LED38.1 26.41,8.25 v1(27.18,9.02) ; LED96.1 52.51,8.81 v1(52.51,8.92) ; v1(63.24,4.39) 63.24,4.05 62.3,3.12 62.3,1.92 U7.11 ; LED76.1 41.24,8.99 v1(41.24,9.01) ; LED6.1 6.2,8.25 v1(6.95,9.01) ; v1(9.75,9.01) 9.67,9.01 LED10.1 ; LED42.1 29.87,8.94 v1(29.94,8.94) ; 14.7,8.25 15.46,9.01 v1(15.46,9.01)
  Inner1 w0.254: v1(62.53,14.78) 62.53,13.51 58.63,9.61 53.2,9.61 v1(52.51,8.92) 52.41,9.02 v1(35.43,9.02) v1(27.18,9.02) v1(24.18,9.02) v1(3.94,9.02)
  Bottom Layer w0.254: v1(63.24,4.39) 63.24,12.76 63.7,13.22 63.7,13.7 62.62,14.78 v1(62.53,14.78)
R6: length 107.3
  Top Layer w0.254: v1(63.12,13.46) 63.12,12.95 63.12,12.95 U6.12 ; v1(44.2,6.35) 44.16,6.35 LED80.1 ; v1(6.86,6.35) 6.77,6.35 LED5.1 ; v1(15.37,6.35) 15.37,6.26 14.7,5.59 ; LED37.1 27.04,6.35 v1(27.18,6.35) ; LED65.1 34.84,5.63 v1(35.56,6.35) ; v1(21.08,6.35) 21.08,6.18 20.49,5.59 ; v1(32.62,6.3) 32.62,6.27 LED45.1 ; LED33.1 24.13,6.34 v1(24.13,6.35) ; v1(9.65,6.35) 9.65,6.33 LED9.1 ; LED21.1 18.22,6.21 v1(18.22,6.32) ; LED70.1 38.48,6.34 v1(38.48,6.35) ; LED13.1 12.32,6.11 v1(12.32,6.35) ; U7.12 63.07,1.95 63.07,3.38 64.01,4.32 v1(64.01,4.45) ; v1(49.91,6.35) 49.82,6.35 LED90.1 ; v1(41.15,6.35) 41.15,6.24 LED75.1 ; v1(46.99,6.35) 46.92,6.35 LED85.1 ; v1(52.71,6.35) 52.71,6.34 LED95.1 ; v1(29.84,6.28) 29.84,6.26 LED41.1 ; LED1.1 3.84,6.31 v1(3.84,6.36)
  Inner1 w0.254: 44.88,6.36 v1(3.84,6.36) ; 44.88,6.36 45.5,6.98 54.59,6.98 ; 44.88,6.36 46.99,6.36 ; 44.88,6.36 43.18,4.66 ; 56.84,7.18 54.8,7.18 54.59,6.98 ; 56.84,7.18 56.59,6.93 55.12,6.93 55.07,6.98 54.59,6.98 ; 56.84,7.18 v1(63.12,13.46) ; 49.91,6.36 52.7,6.36 v1(52.71,6.35) 53.97,6.35 54.59,6.98
  Inner2 w0.254: v1(63.12,13.46) 63.12,5.33 v1(64.01,4.45)
$1N8371: length 14.6
  Top Layer w0.254: LED100.2 LED53.2 LED4.2 LED3.2 LED2.2 1.99,4.4 R1.2
$1N8417: length 14.6
  Top Layer w0.254: LED101.2 LED54.2 LED8.2 LED7.2 LED6.2 LED5.2 ; LED5.2 6.11,3.24 ; LED5.2 4.89,4.42
$1N8463: length 14.6
  Top Layer w0.254: 9.02,3.2 7.78,4.44 7.78,17.26
$1N8509: length 14.6
  Top Layer w0.254: LED103.2 LED56.2 LED16.2 LED15.2 LED14.2 10.68,4.46 R4.2
$1N8555: length 14.6
  Top Layer w0.254: LED104.2 LED57.2 LED20.2 LED19.2 LED18.2 13.57,4.48 R5.2
$1N8601: length 14.5
  Top Layer w0.254: R6.2 16.47,4.37 LED22.2 LED23.2 LED24.2 LED58.2 LED105.2
$1N8647: length 14.6
  Top Layer w0.254: LED106.2 LED59.2 LED28.2 LED27.2 LED26.2 LED25.2 19.42,4.46 R7.2
$1N8693: length 14.6
  Top Layer w0.254: 23.47,3.2 22.26,4.41 LED34.2 LED35.2 LED36.2 LED60.2 LED107.2
$1N8739: length 14.6
  Top Layer w0.254: R9.2 25.15,4.43 LED38.2 LED39.2 LED40.2 LED61.2 LED108.2
$1N8785: length 14.6
  Top Layer w0.254: 28.05,17.26 28.05,4.46 29.3,3.21 R10.2
$1N8831: length 14.6
  Top Layer w0.254: R11.2 30.81,4.47 30.81,17.26
$1N31146: length 14.6
  Top Layer w0.254: R13.2 33.71,4.49 LED66.2 LED67.2 LED68.2 LED69.2 LED112.2
$1N31526: length 14.5
  Top Layer w0.254: 36.6,17.26 36.6,4.51 ; 36.6,4.46 37.87,3.2
$1N31916: length 14.6
  Top Layer w0.254: R15.2 39.37,4.53 39.37,17.26
$1N32316: length 14.6
  Top Layer w0.254: 43.61,3.2 42.27,4.55 LED81.2 LED82.2 LED83.2 LED84.2 LED115.2
$1N32726: length 14.6
  Top Layer w0.254: LED116.2 LED89.2 LED88.2 LED87.2 LED86.2 45.04,4.57 R17.2
$1N33146: length 14.6
  Top Layer w0.254: R18.2 47.93,4.46 LED91.2 LED92.2 LED93.2 LED94.2 LED117.2
$1N33576: length 14.6
  Top Layer w0.254: LED118.2 LED99.2 LED98.2 LED97.2 LED96.2 50.83,4.48 R19.2
$1N35107: length 23
  Top Layer w0.254: v1(59.31,14.61) 59.22,14.52 U6.6
  Bottom Layer w0.254: v1(59.31,14.61) 59.94,15.24 59.94,16.09 59.52,16.51 56.98,16.51 56.58,16.11 56.57,16.11 55.19,14.72 R20.2
$1N35273: length 27.6
  Top Layer w0.254: U6.16 63.75,18.55 63.75,16.89 64.14,16.51 64.52,16.51 v1(64.54,16.48)
  Bottom Layer w0.254: C1.1 63.82,17.21 v1(64.54,16.48)
$1N35811: length 5.8
  Top Layer w0.254: C2.1 65.85,8.06 64.71,6.92 64.2,6.92 63.65,7.47 63.65,8.79
$1N35823: length 8.8
  Top Layer w0.254: U7.6 59.06,1.84 59.06,1.09 59.56,0.59 65.49,0.59 65.67,0.77 R21.2
$1N36756: length 6.2
  Top Layer w0.254: U7.18 62.35,7.76 63.63,6.48 66.74,6.48 66.93,6.29
$1N36796: length 6.1
  Top Layer w0.254: U6.18 62.47,17.41 64.32,15.56 C4.1

## Copper pours and planes (outline as drawn; the poured copper is in the pictures)
GND on Bottom Layer: -23.62,28.96 103.89,28.96 103.89,-35.69 -23.62,-35.69
VCC on Top Layer: 93.34,23.88 93.34,-16.51 92.58,-17.27 -19.3,-17.27 -27.18,-9.4 -27.18,34.04 -25.91,35.31 81.92,35.31
